# EAGLE schematic Adafruit ICM20948 (EAGLE 9.6.2)
COMPANY: ADAFRUIT INDUSTRIES; DRAWN: KTOWN; REV: A
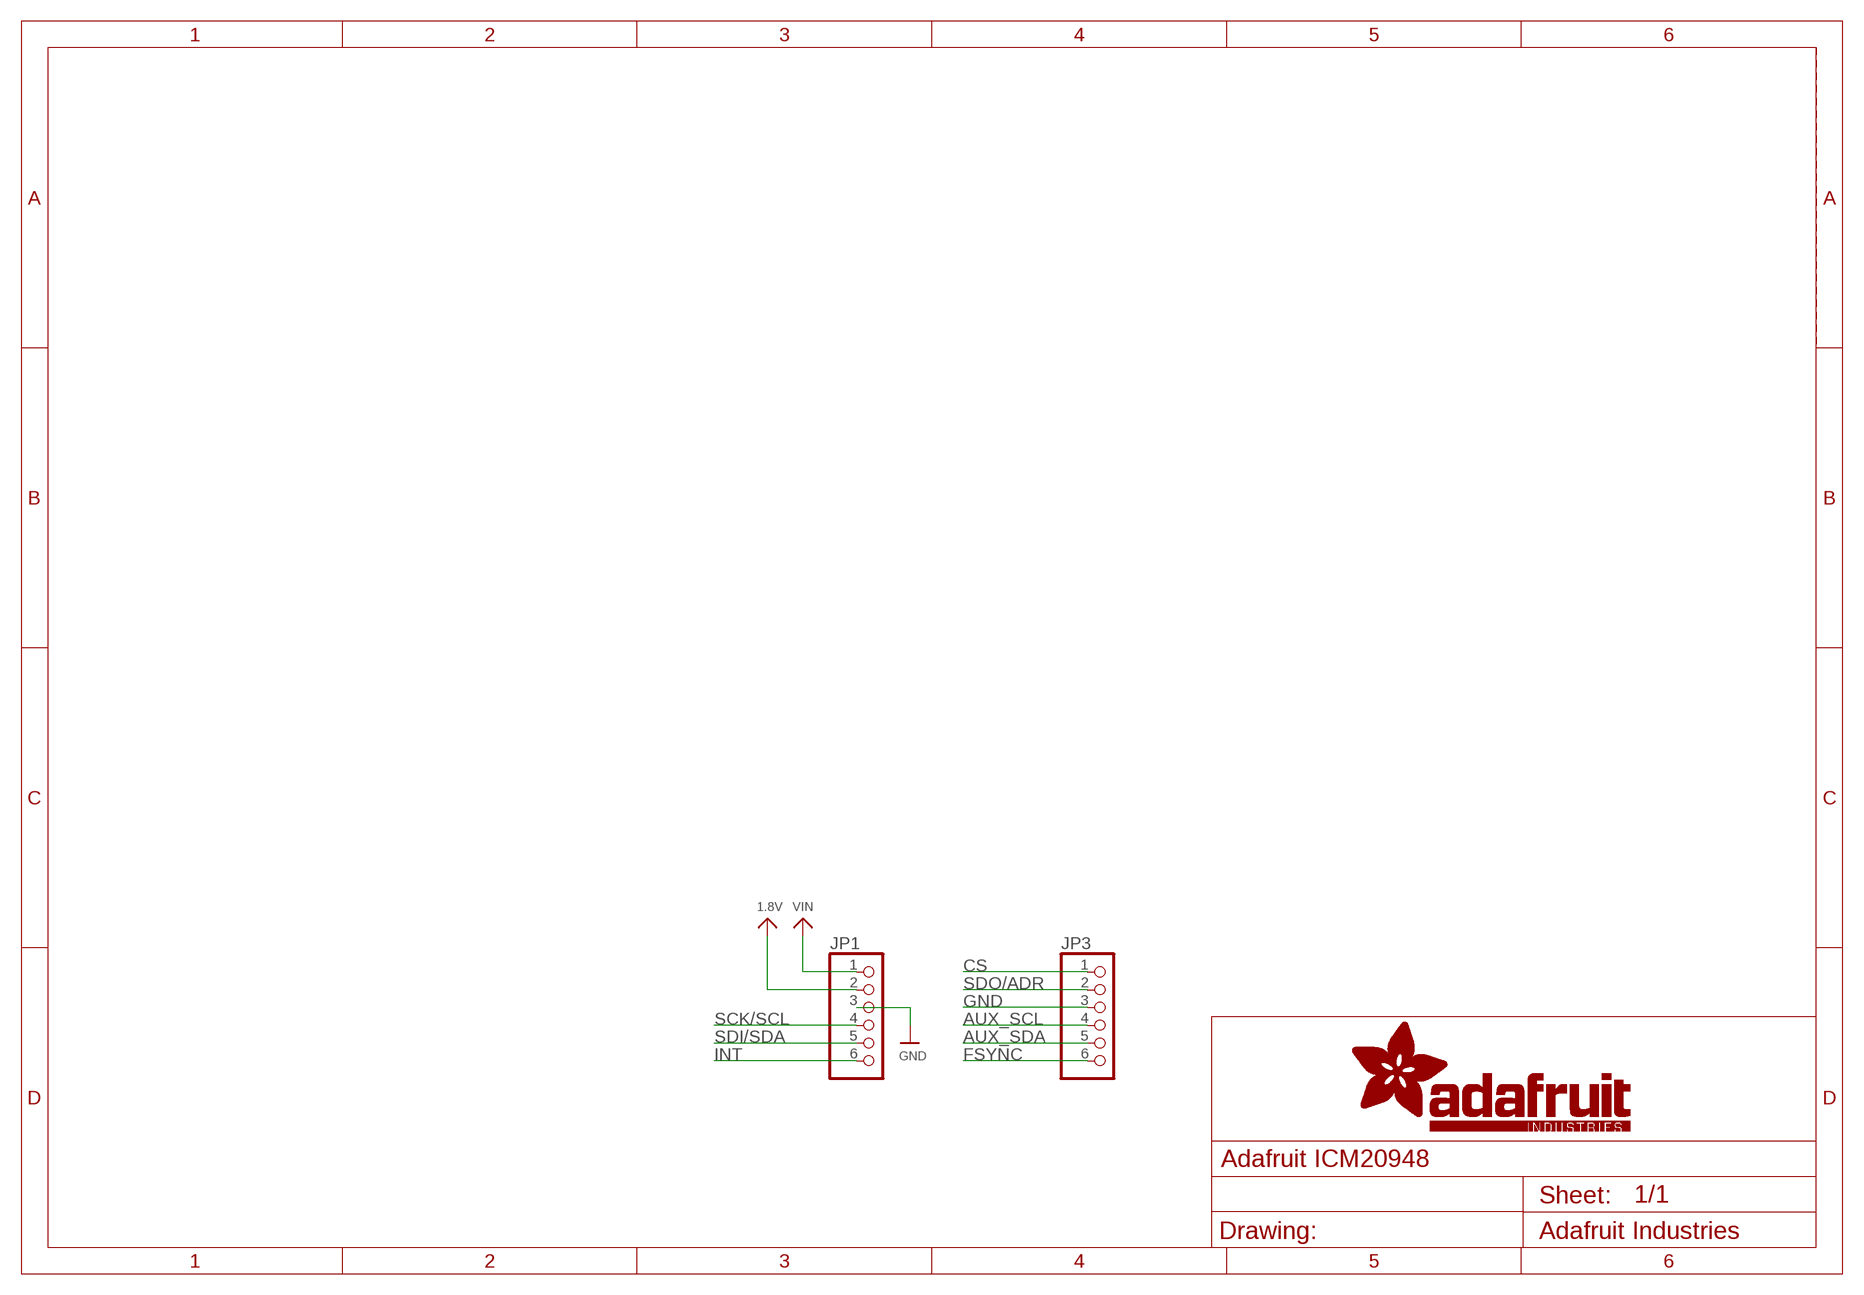
[diagram p0: schematic, sheet 1]

## Parts
JP1  HEADER-1X670MIL  [1X06_ROUND_70]
JP3  HEADER-1X670MIL  [1X06_ROUND_70]

## Nets
1.8V: JP1.2
AUX_SCL: JP3.4
AUX_SDA: JP3.5
CS: JP3.1
FSYNC: JP3.6
GND: JP1.3 JP3.3
INT: JP1.6
SCK/SCL: JP1.4
SDI/SDA: JP1.5
SDO/ADR: JP3.2
VIN: JP1.1

## Library data of the parts
JP1 JP3 = microbuilder:HEADER-1X6: PIN HEADER

## Net classes
1 highpower: width 0.406 mm, drill 0.483 mm
2 lowpower: width 0.305 mm, drill 0.483 mm